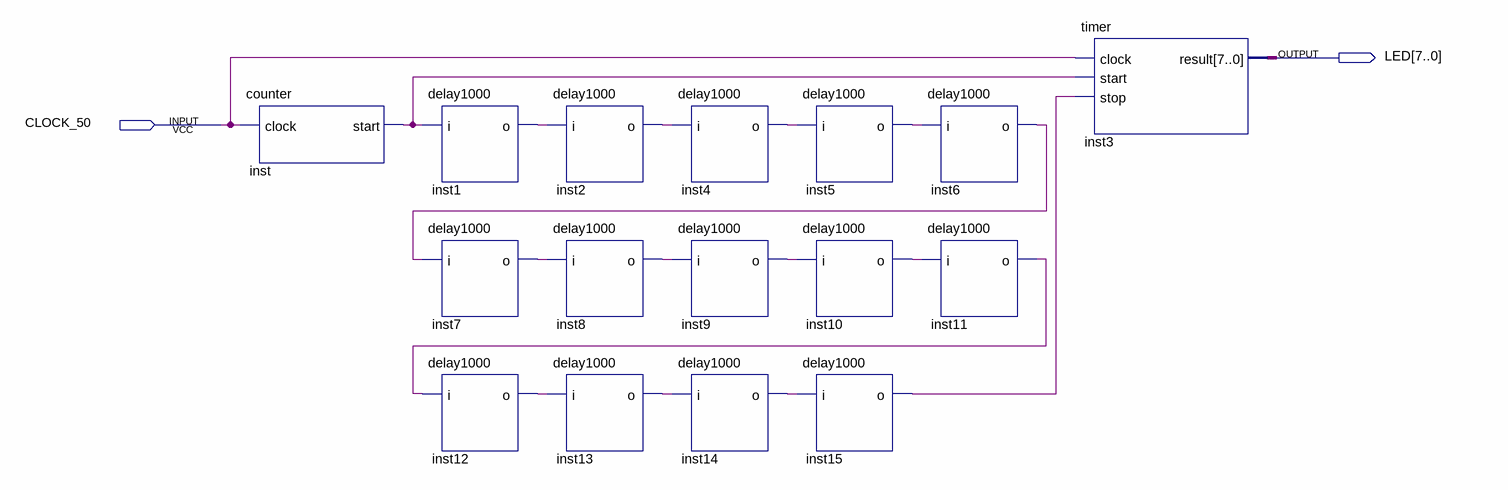
[diagram p0: schematic sheet]
// Quartus schematic LATENCY.bdf as structural Verilog: 16 symbols, 2 pins
module LATENCY (
  input  CLOCK_50,
  output [7:0] LED
);

  wire inst1_o, inst2_o, inst4_o, inst5_o, inst6_o, inst7_o, inst8_o, inst9_o, inst10_o, inst11_o, inst12_o,
       inst13_o, inst14_o, inst15_o, inst_start;

  counter inst (.clock(CLOCK_50), .start(inst_start));
  delay1000 inst1 (.i(inst_start), .o(inst1_o));
  delay1000 inst7 (.i(inst6_o), .o(inst7_o));
  delay1000 inst12 (.i(inst11_o), .o(inst12_o));
  delay1000 inst2 (.i(inst1_o), .o(inst2_o));
  delay1000 inst8 (.i(inst7_o), .o(inst8_o));
  delay1000 inst13 (.i(inst12_o), .o(inst13_o));
  delay1000 inst4 (.i(inst2_o), .o(inst4_o));
  delay1000 inst9 (.i(inst8_o), .o(inst9_o));
  delay1000 inst14 (.i(inst13_o), .o(inst14_o));
  delay1000 inst5 (.i(inst4_o), .o(inst5_o));
  delay1000 inst10 (.i(inst9_o), .o(inst10_o));
  delay1000 inst15 (.i(inst14_o), .o(inst15_o));
  delay1000 inst6 (.i(inst5_o), .o(inst6_o));
  delay1000 inst11 (.i(inst10_o), .o(inst11_o));
  timer inst3 (.clock(CLOCK_50), .start(inst_start), .stop(inst15_o), .result(LED));
endmodule
